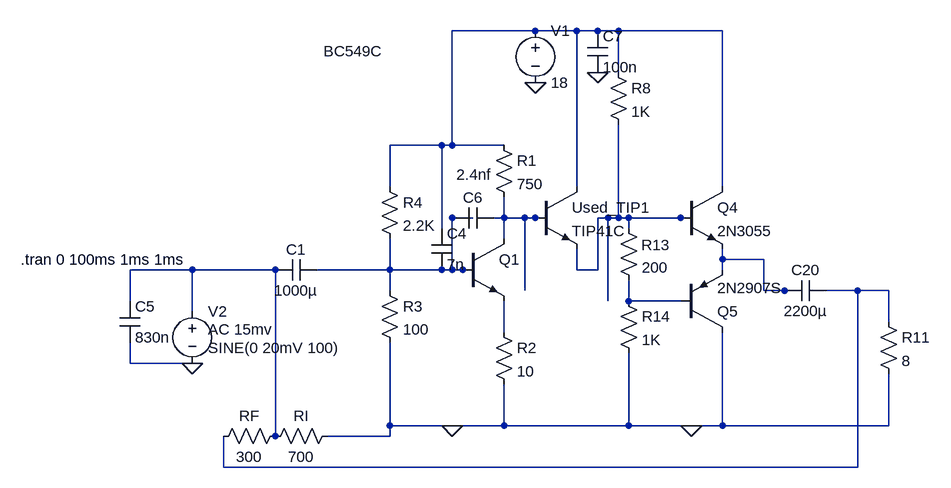
[diagram p0: schematic CE BC549 Tip122 with Push Pull and  FB and no bypass caps.asc]
CE BC549 Tip122 with Push Pull and  FB and no bypass caps.asc, the LTspice schematic file:
Version 4
SHEET 1 1624 680
WIRE 272 -256 144 -256
WIRE 336 -256 272 -256
WIRE 368 -256 336 -256
WIRE 400 -256 368 -256
WIRE 560 -256 400 -256
WIRE 400 -192 400 -256
WIRE 128 -80 48 -80
WIRE 144 -80 144 -256
WIRE 144 -80 128 -80
WIRE 224 -80 144 -80
WIRE 48 -16 48 -80
WIRE 336 -16 336 -256
WIRE 560 -16 560 -256
WIRE 176 32 144 32
WIRE 224 32 224 0
WIRE 224 32 208 32
WIRE 256 32 224 32
WIRE 272 32 256 32
WIRE 288 32 272 32
WIRE 384 32 368 32
WIRE 400 32 400 -112
WIRE 400 32 384 32
WIRE 416 32 400 32
WIRE 496 32 416 32
WIRE 512 32 496 32
WIRE 128 48 128 -80
WIRE 416 48 416 32
WIRE 224 64 224 32
WIRE 560 96 560 80
WIRE 624 96 560 96
WIRE -256 112 -352 112
WIRE -128 112 -256 112
WIRE -112 112 -128 112
WIRE 48 112 48 64
WIRE 48 112 -64 112
WIRE 128 112 48 112
WIRE 144 112 144 32
WIRE 144 112 128 112
WIRE 160 112 144 112
WIRE 176 112 160 112
WIRE 336 112 336 80
WIRE 368 112 368 32
WIRE 368 112 336 112
WIRE 560 112 560 96
WIRE 48 144 48 112
WIRE 256 144 256 32
WIRE 624 144 624 96
WIRE 656 144 624 144
WIRE 672 144 656 144
WIRE 768 144 720 144
WIRE 816 144 768 144
WIRE -352 160 -352 112
WIRE 384 160 384 32
WIRE 416 160 416 128
WIRE 496 160 416 160
WIRE -256 176 -256 112
WIRE 816 192 816 144
WIRE 224 208 224 160
WIRE -352 256 -352 224
WIRE -272 256 -352 256
WIRE 48 352 48 224
WIRE 144 352 48 352
WIRE 224 352 224 288
WIRE 224 352 144 352
WIRE 416 352 416 240
WIRE 416 352 224 352
WIRE 512 352 416 352
WIRE 560 352 560 208
WIRE 560 352 512 352
WIRE 816 352 816 272
WIRE 816 352 560 352
WIRE -128 368 -128 112
WIRE 48 368 48 352
WIRE 48 368 -48 368
WIRE -208 416 -208 368
WIRE 768 416 768 144
WIRE 768 416 -208 416
FLAG 272 -176 0
FLAG 144 352 0
FLAG -256 256 0
FLAG 368 -192 0
FLAG 512 352 0
SYMBOL npn 160 64 R0
WINDOW 3 -214 -289 Left 2
SYMATTR InstName Q1
SYMATTR Value BC549C
SYMBOL res 208 -96 R0
SYMATTR InstName R1
SYMATTR Value 750
SYMBOL voltage 272 -272 R0
WINDOW 123 0 0 Left 2
WINDOW 39 0 0 Left 2
SYMATTR InstName V1
SYMATTR Value 18
SYMBOL res 32 -32 R0
SYMATTR InstName R4
SYMATTR Value 2.2K
SYMBOL res 32 128 R0
SYMATTR InstName R3
SYMATTR Value 100
SYMBOL res 208 192 R0
SYMATTR InstName R2
SYMATTR Value 10
SYMBOL cap -64 96 R90
WINDOW 0 0 32 VBottom 2
WINDOW 3 32 32 VTop 2
SYMATTR InstName C1
SYMATTR Value 1000µ
SYMBOL voltage -256 160 R0
WINDOW 123 24 44 Left 2
WINDOW 39 0 0 Left 2
WINDOW 3 24 72 Left 2
SYMATTR Value2 AC 15mv
SYMATTR Value SINE(0 20mV 100)
SYMATTR InstName V2
SYMBOL res -112 352 R90
WINDOW 0 0 56 VBottom 2
WINDOW 3 32 56 VTop 2
SYMATTR InstName RF
SYMATTR Value 300
SYMBOL res -32 352 R90
WINDOW 0 0 56 VBottom 2
WINDOW 3 32 56 VTop 2
SYMATTR InstName RI
SYMATTR Value 700
SYMBOL cap 112 48 R0
SYMATTR InstName C4
SYMATTR Value 7n
SYMBOL cap -368 160 R0
SYMATTR InstName C5
SYMATTR Value 830n
SYMBOL cap 208 16 R90
WINDOW 0 0 32 VBottom 2
WINDOW 3 -66 30 VTop 2
SYMATTR InstName C6
SYMATTR Value 2.4nf
SYMBOL cap 352 -256 R0
SYMATTR InstName C7
SYMATTR Value 100n
SYMBOL res 384 -208 R0
SYMATTR InstName R8
SYMATTR Value 1K
SYMBOL npn2 496 -16 R0
SYMATTR InstName Q4
SYMATTR Value 2N3055
SYMBOL res 800 176 R0
SYMATTR InstName R11
SYMATTR Value 8
SYMBOL pnp 496 208 M180
SYMATTR InstName Q5
SYMATTR Value 2N2907S
SYMBOL res 400 32 R0
WINDOW 0 35 42 Left 2
SYMATTR InstName R13
SYMATTR Value 200
SYMBOL res 400 144 R0
SYMATTR InstName R14
SYMATTR Value 1K
SYMBOL cap 720 128 R90
WINDOW 0 0 32 VBottom 2
WINDOW 3 32 32 VTop 2
SYMATTR InstName C20
SYMATTR Value 2200µ
SYMBOL npn 272 -16 R0
SYMATTR InstName Used_TIP1
SYMATTR Value TIP41C
TEXT -520 96 Left 2 !.tran 0 100ms 1ms 1ms

The netlist it stands for:
* CE BC549 Tip122 with Push Pull and  FB and no bypass caps.asc
Q1 N003 N002 N009 0 BC549C
R1 N001 N003 750
V1 N001 0 18
R4 N001 N002 2.2K
R3 N002 0 100
R2 N009 0 10
C1 N002 N006 1000µ
V2 N006 0 SINE(0 20mV 100) AC 15mv
RF N006 N007 300
RI 0 N006 700
C4 N001 N002 7n
C5 N006 N010 830n
C6 N003 N002 2.4nf
C7 N001 0 100n
R8 N001 N004 1K
Q4 N001 N004 N005 0 2N3055
R11 N007 0 8
Q5 0 N008 N005 0 2N2907S
R13 N004 N008 200
R14 N008 0 1K
C20 N007 N005 2200µ
Q§Used_TIP1 N001 N003 N004 0 TIP41C
.model NPN NPN
.model PNP PNP
.lib standard.bjt
.tran 0 100ms 1ms 1ms
.backanno
.end